# Altium schematic sheet Channel_B.SchDoc
size OrCAD E; SheetNumber: 4; SheetTotal: 4
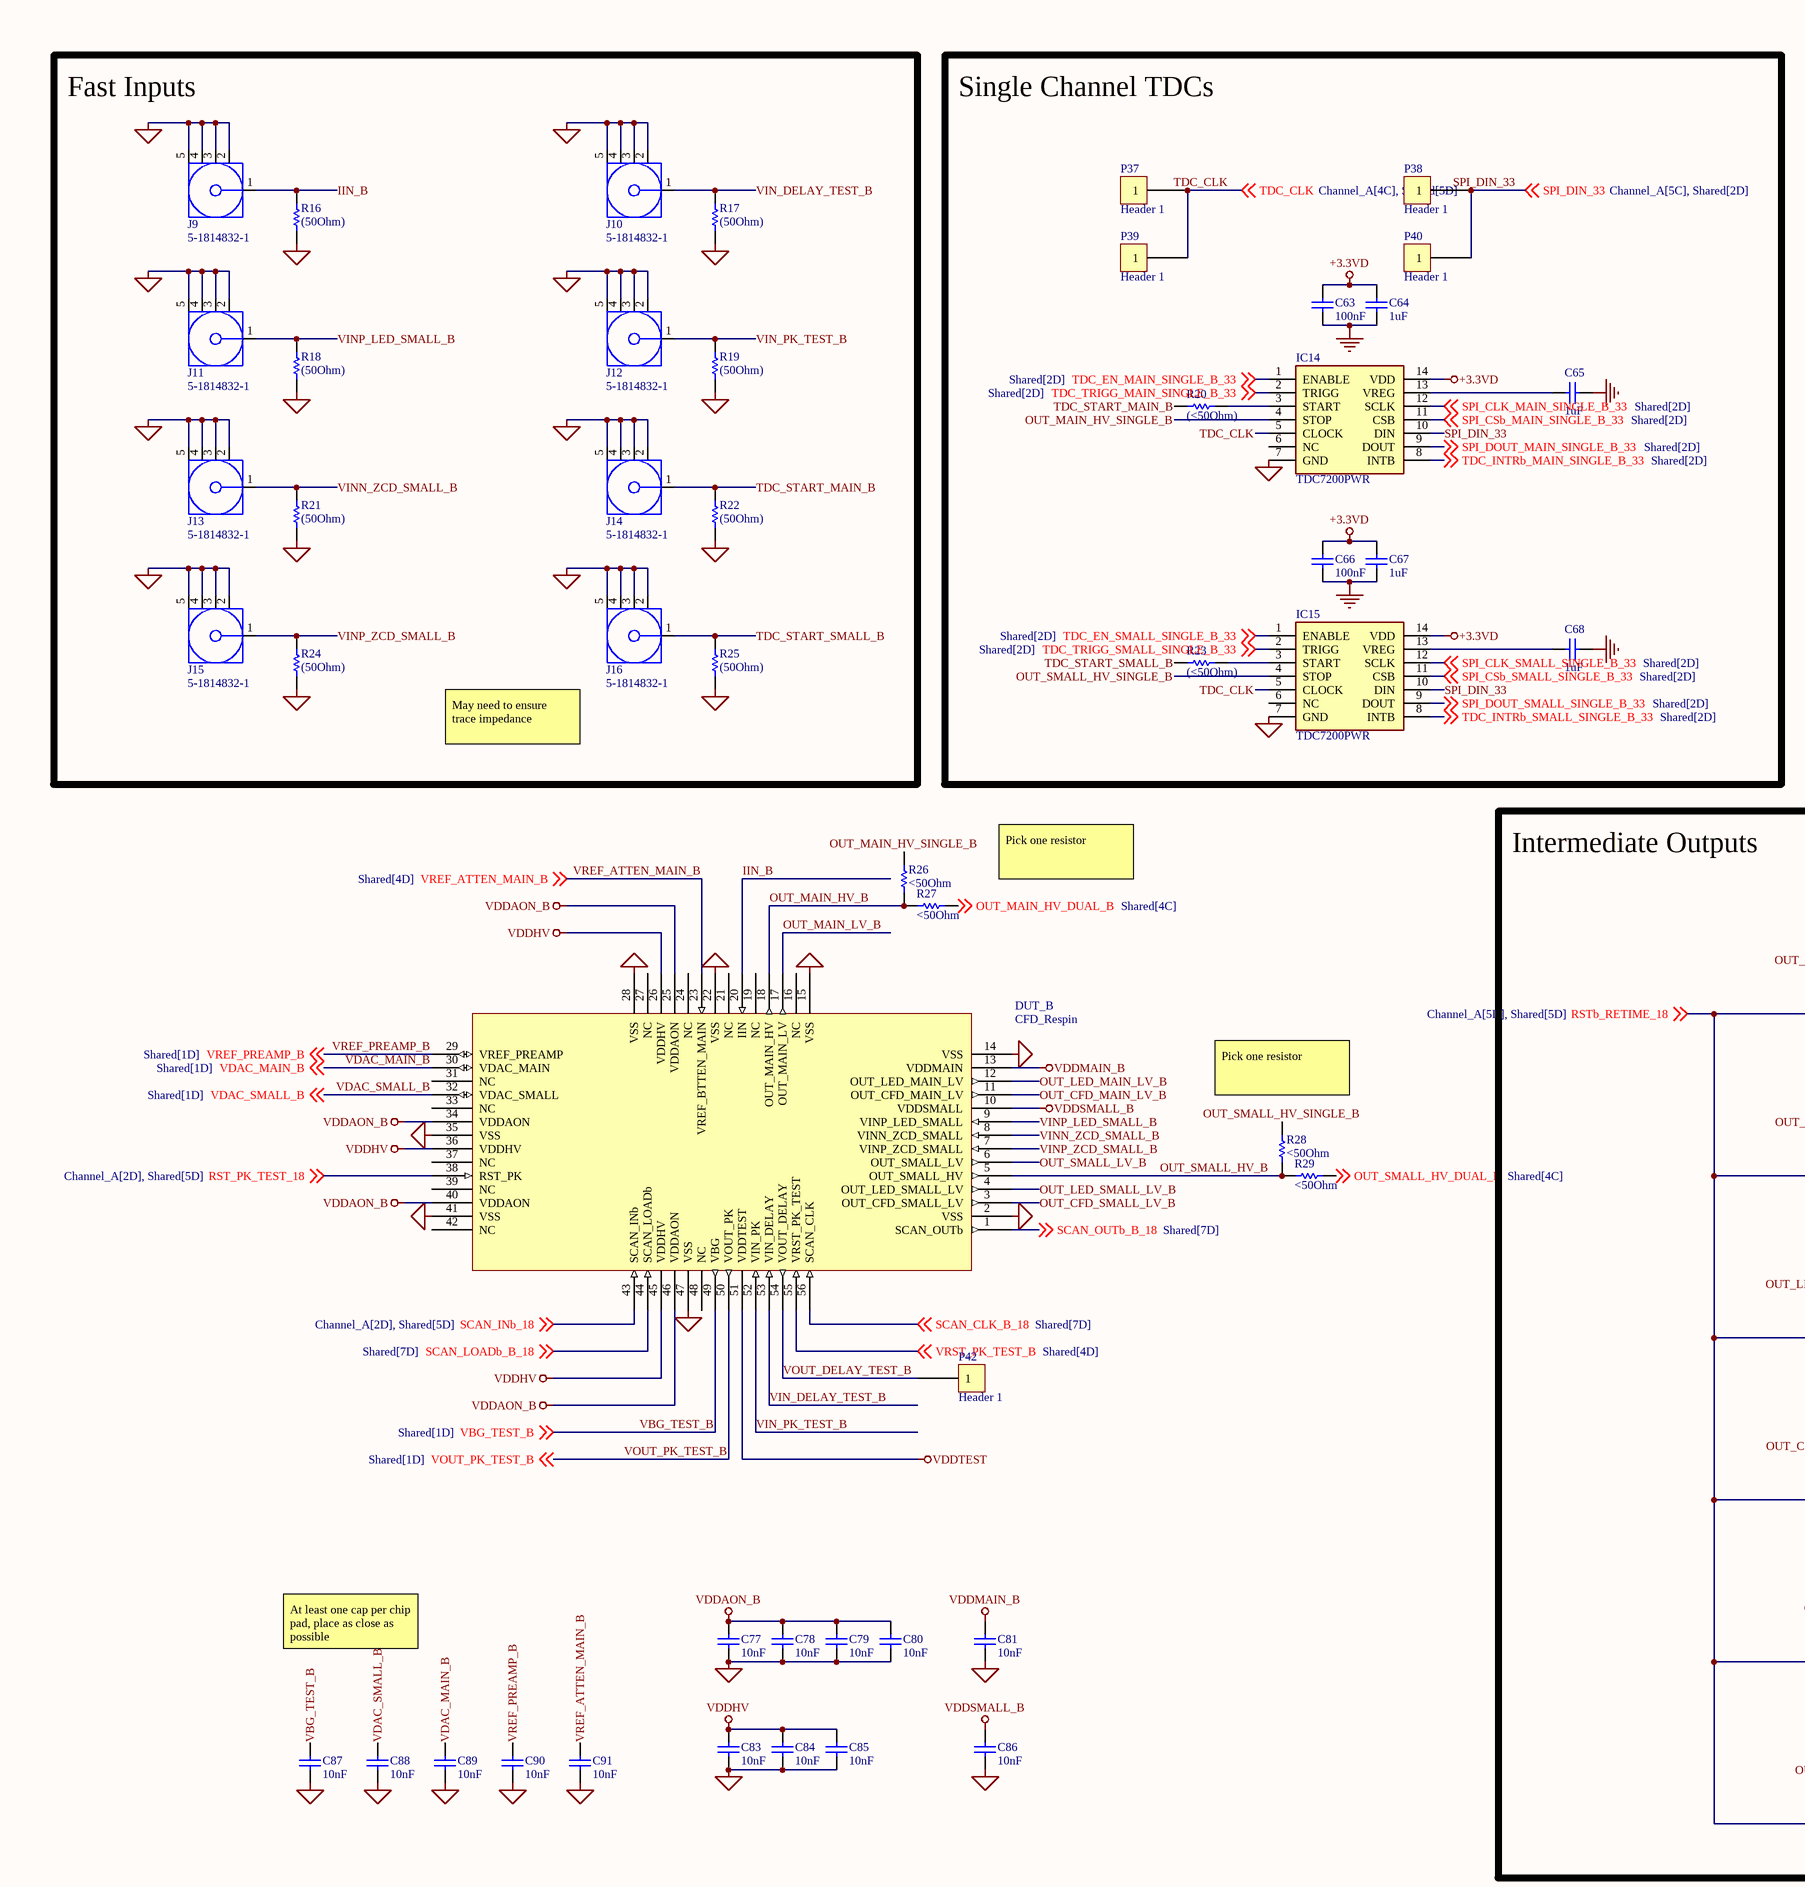
[diagram p0: Channel_B.SchDoc, left]
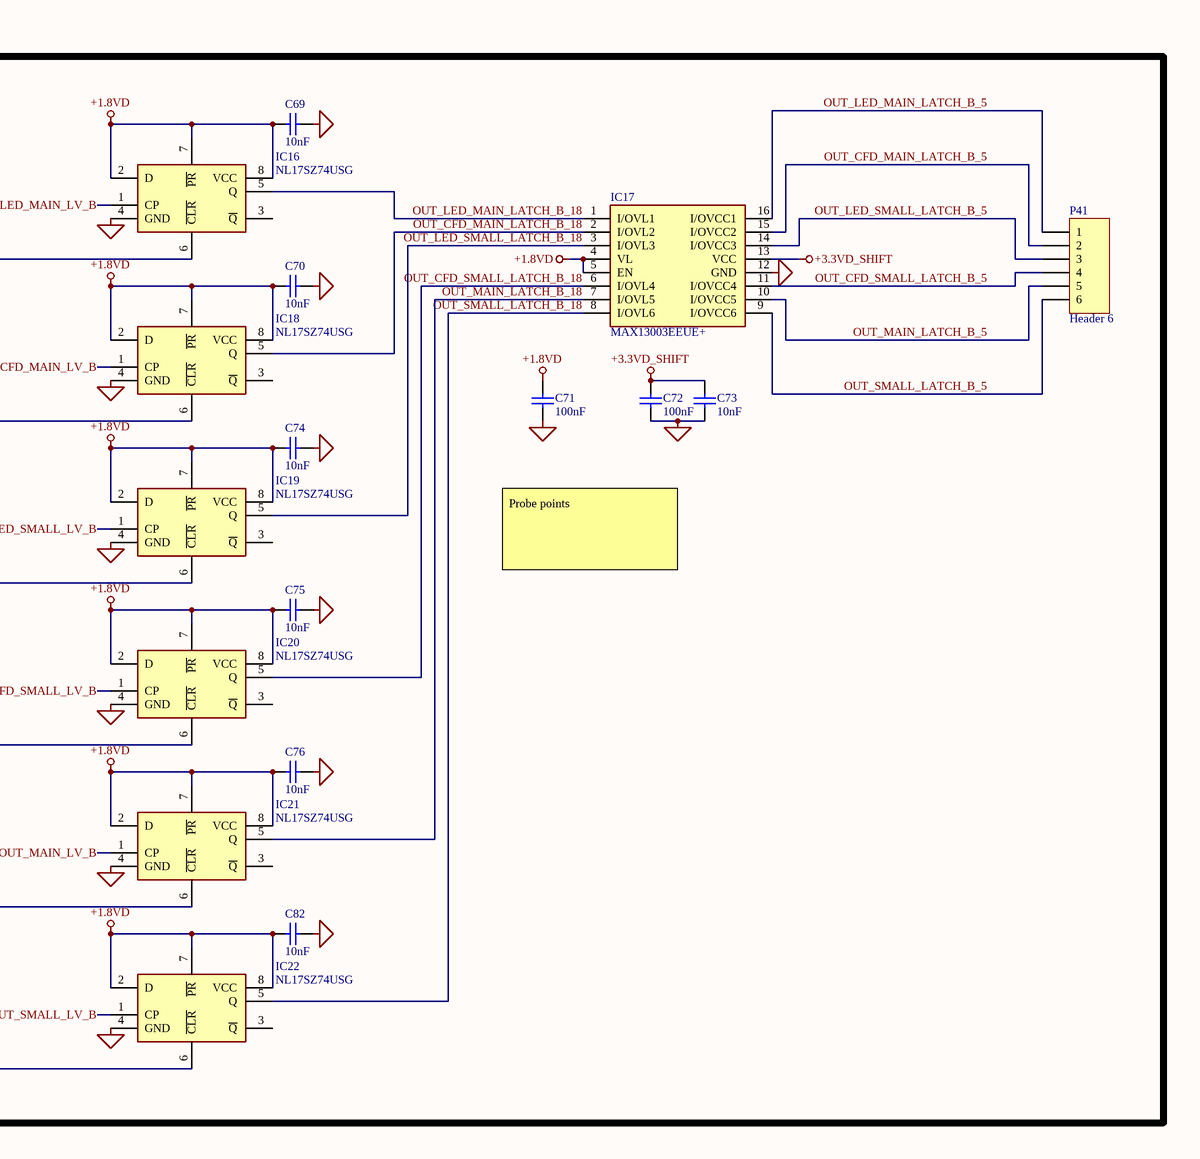
[diagram p1: Channel_B.SchDoc, right]

## Parts
C63  100nF  [CAPC1608X90X35ML10T15]
C64  1uF  [CAPC1608X90X35ML10T15]
C65  1uF  [CAPC1608X90X35ML10T15]
C66  100nF  [CAPC1608X90X35ML10T15]
C67  1uF  [CAPC1608X90X35ML10T15]
C68  1uF  [CAPC1608X90X35ML10T15]
C69  10nF  [CAPC1608X90X35ML10T15]
C70  10nF  [CAPC1608X90X35ML10T15]
C71  100nF  [CAPC1608X90X35ML10T15]
C72  100nF  [CAPC1608X90X35ML10T15]
C73  10nF  [CAPC1608X90X35ML10T15]
C74  10nF  [CAPC1608X90X35ML10T15]
C75  10nF  [CAPC1608X90X35ML10T15]
C76  10nF  [CAPC1608X90X35ML10T15]
C77  10nF  [CAPC1608X90X35ML10T15]
C78  10nF  [CAPC1608X90X35ML10T15]
C79  10nF  [CAPC1608X90X35ML10T15]
C80  10nF  [CAPC1608X90X35ML10T15]
C81  10nF  [CAPC1608X90X35ML10T15]
C82  10nF  [CAPC1608X90X35ML10T15]
C83  10nF  [CAPC1608X90X35ML10T15]
C84  10nF  [CAPC1608X90X35ML10T15]
C85  10nF  [CAPC1608X90X35ML10T15]
C86  10nF  [CAPC1608X90X35ML10T15]
C87  10nF  [CAPC1608X90X35ML10T15]
C88  10nF  [CAPC1608X90X35ML10T15]
C89  10nF  [CAPC1608X90X35ML10T15]
C90  10nF  [CAPC1608X90X35ML10T15]
C91  10nF  [CAPC1608X90X35ML10T15]
DUT_B  CFD_Respin  [QFN50P800X800X80_HS-57N_WIDEVIAS]
IC14  TDC7200PWR  [SOP65P640X120-14N]
IC15  TDC7200PWR  [SOP65P640X120-14N]
IC16  NL17SZ74USG  [SOP50P310X90-8N]
IC17  MAX13003EEUE+  [SOP65P640X110-16N]
IC18  NL17SZ74USG  [SOP50P310X90-8N]
IC19  NL17SZ74USG  [SOP50P310X90-8N]
IC20  NL17SZ74USG  [SOP50P310X90-8N]
IC21  NL17SZ74USG  [SOP50P310X90-8N]
IC22  NL17SZ74USG  [SOP50P310X90-8N]
J9  5-1814832-1  [TECO-5-1814832-1_V]
J10  5-1814832-1  [TECO-5-1814832-1_V]
J11  5-1814832-1  [TECO-5-1814832-1_V]
J12  5-1814832-1  [TECO-5-1814832-1_V]
J13  5-1814832-1  [TECO-5-1814832-1_V]
J14  5-1814832-1  [TECO-5-1814832-1_V]
J15  5-1814832-1  [TECO-5-1814832-1_V]
J16  5-1814832-1  [TECO-5-1814832-1_V]
P37  Header 1  [Header1]
P38  Header 1  [Header1]
P39  Header 1  [Header1]
P40  Header 1  [Header1]
P41  Header 6  [HDR1X6]
P42  Header 1  [Header1]
R16  (50Ohm)  [RESC1609X50X30NL8T20]
R17  (50Ohm)  [RESC1609X50X30NL8T20]
R18  (50Ohm)  [RESC1609X50X30NL8T20]
R19  (50Ohm)  [RESC1609X50X30NL8T20]
R20  (<50Ohm)  [RESC1609X50X30NL8T20]
R21  (50Ohm)  [RESC1609X50X30NL8T20]
R22  (50Ohm)  [RESC1609X50X30NL8T20]
R23  (<50Ohm)  [RESC1609X50X30NL8T20]
R24  (50Ohm)  [RESC1609X50X30NL8T20]
R25  (50Ohm)  [RESC1609X50X30NL8T20]
R26  <50Ohm  [RESC1609X50X30NL8T20]
R27  <50Ohm  [RESC1609X50X30NL8T20]
R28  <50Ohm  [RESC1609X50X30NL8T20]
R29  <50Ohm  [RESC1609X50X30NL8T20]

## Blocks framed on the sheet
Fast Inputs: J9-J16 R16-R19 R21 R22 R24 R25
Single Channel TDCs: C63-C68 IC14 IC15 P37-P40 R20 R23
Intermediate Outputs: C69-C76 C82 IC16-IC22 P41

## Nets
+1.8VD: C69.2 C70.2 C71.2 C74.2 C75.2 C76.2 C82.2 IC16.2(D) IC16.7(~{PR}) IC16.8(VCC) IC17.4(VL) IC17.5(EN) IC18.2(D) IC18.7(~{PR}) IC18.8(VCC) IC19.2(D) IC19.7(~{PR}) IC19.8(VCC) IC20.2(D) IC20.7(~{PR}) IC20.8(VCC) IC21.2(D) IC21.7(~{PR}) IC21.8(VCC) IC22.2(D) IC22.7(~{PR}) IC22.8(VCC)
+3.3VD: C63.1 C64.1 C66.1 C67.1 IC14.14(VDD) IC15.14(VDD)
+3.3VD_SHIFT: C72.2 C73.2 IC17.13(VCC)
GND: C63.2 C64.2 C65.2 C66.2 C67.2 C68.2 C69.1 C70.1 C71.1 C72.1 C73.1 C74.1 C75.1 C76.1 C77.1 C78.1 C79.1 C80.1 C81.1 C82.1 C83.1 C84.1 C85.1 C86.1 C87.1 C88.1 C89.1 C90.1 C91.1 DUT_B.2(VSS) DUT_B.14(VSS) DUT_B.15(VSS) DUT_B.22(VSS) DUT_B.28(VSS) DUT_B.35(VSS) DUT_B.41(VSS) DUT_B.47(VSS) IC14.7(GND) IC15.7(GND) IC16.4(GND) IC17.12(GND) IC18.4(GND) IC19.4(GND) IC20.4(GND) IC21.4(GND) IC22.4(GND) J9.2 J9.3 J9.4 J9.5 J10.2 J10.3 J10.4 J10.5 J11.2 J11.3 J11.4 J11.5 J12.2 J12.3 J12.4 J12.5 J13.2 J13.3 J13.4 J13.5 J14.2 J14.3 J14.4 J14.5 J15.2 J15.3 J15.4 J15.5 J16.2 J16.3 J16.4 J16.5 R16.1 R17.1 R18.1 R19.1 R21.1 R22.1 R24.1 R25.1
VDDAON_B: C77.2 C78.2 C79.2 C80.2 DUT_B.25(VDDAON) DUT_B.34(VDDAON) DUT_B.40(VDDAON) DUT_B.46(VDDAON)
VDDHV: C83.2 C84.2 C85.2 DUT_B.26(VDDHV) DUT_B.36(VDDHV) DUT_B.45(VDDHV)
VDDMAIN_B: C81.2 DUT_B.13(VDDMAIN)
VDDSMALL_B: C86.2 DUT_B.10(VDDSMALL)
VDDTEST: DUT_B.51(VDDTEST)
IIN_B: DUT_B.20(IIN) J9.1 R16.2
OUT_CFD_MAIN_LATCH_B_5: IC17.15(I/OVCC2) P41.2
OUT_CFD_MAIN_LATCH_B_18: IC17.2(I/OVL2) IC18.5(Q)
OUT_CFD_MAIN_LV_B: DUT_B.11(OUT_CFD_MAIN_LV) IC18.1(CP)
OUT_CFD_SMALL_LATCH_B_5: IC17.11(I/OVCC4) P41.4
OUT_CFD_SMALL_LATCH_B_18: IC17.6(I/OVL4) IC20.5(Q)
OUT_CFD_SMALL_LV_B: DUT_B.3(OUT_CFD_SMALL_LV) IC20.1(CP)
OUT_LED_MAIN_LATCH_B_5: IC17.16(I/OVCC1) P41.1
OUT_LED_MAIN_LATCH_B_18: IC16.5(Q) IC17.1(I/OVL1)
OUT_LED_MAIN_LV_B: DUT_B.12(OUT_LED_MAIN_LV) IC16.1(CP)
OUT_LED_SMALL_LATCH_B_5: IC17.14(I/OVCC3) P41.3
OUT_LED_SMALL_LATCH_B_18: IC17.3(I/OVL3) IC19.5(Q)
OUT_LED_SMALL_LV_B: DUT_B.4(OUT_LED_SMALL_LV) IC19.1(CP)
OUT_MAIN_HV_B: DUT_B.18(OUT_MAIN_HV) R26.2 R27.1
OUT_MAIN_HV_DUAL_B: R27.2 ; off-sheet OUT_MAIN_HV_DUAL_B
OUT_MAIN_HV_SINGLE_B: IC14.4(STOP) R26.1
OUT_MAIN_LATCH_B_5: IC17.10(I/OVCC5) P41.5
OUT_MAIN_LATCH_B_18: IC17.7(I/OVL5) IC21.5(Q)
OUT_MAIN_LV_B: DUT_B.17(OUT_MAIN_LV) IC21.1(CP)
OUT_SMALL_HV_B: DUT_B.5(OUT_SMALL_HV) R28.2 R29.1
OUT_SMALL_HV_DUAL_B: R29.2 ; off-sheet OUT_SMALL_HV_DUAL_B
OUT_SMALL_HV_SINGLE_B: IC15.4(STOP) R28.1
OUT_SMALL_LATCH_B_5: IC17.9(I/OVCC6) P41.6
OUT_SMALL_LATCH_B_18: IC17.8(I/OVL6) IC22.5(Q)
OUT_SMALL_LV_B: DUT_B.6(OUT_SMALL_LV) IC22.1(CP)
RST_PK_TEST_18: DUT_B.38(RST_PK) ; off-sheet RST_PK_TEST_18
RSTb_RETIME_18: IC16.6(~{CLR}) IC18.6(~{CLR}) IC19.6(~{CLR}) IC20.6(~{CLR}) IC21.6(~{CLR}) IC22.6(~{CLR}) ; off-sheet RSTb_RETIME_18
SCAN_CLK_B_18: DUT_B.56(SCAN_CLK) ; off-sheet SCAN_CLK_B_18
SCAN_INb_18: DUT_B.43(SCAN_INb) ; off-sheet SCAN_INb_18
SCAN_LOADb_B_18: DUT_B.44(SCAN_LOADb) ; off-sheet SCAN_LOADb_B_18
SCAN_OUTb_B_18: DUT_B.1(SCAN_OUTb) ; off-sheet SCAN_OUTb_B_18
SPI_CLK_MAIN_SINGLE_B_33: IC14.12(SCLK) ; off-sheet SPI_CLK_MAIN_SINGLE_B_33
SPI_CLK_SMALL_SINGLE_B_33: IC15.12(SCLK) ; off-sheet SPI_CLK_SMALL_SINGLE_B_33
SPI_CSb_MAIN_SINGLE_B_33: IC14.11(CSB) ; off-sheet SPI_CSb_MAIN_SINGLE_B_33
SPI_CSb_SMALL_SINGLE_B_33: IC15.11(CSB) ; off-sheet SPI_CSb_SMALL_SINGLE_B_33
SPI_DIN_33: IC14.10(DIN) IC15.10(DIN) P38.1 P40.1 ; off-sheet SPI_DIN_33
SPI_DOUT_MAIN_SINGLE_B_33: IC14.9(DOUT) ; off-sheet SPI_DOUT_MAIN_SINGLE_B_33
SPI_DOUT_SMALL_SINGLE_B_33: IC15.9(DOUT) ; off-sheet SPI_DOUT_SMALL_SINGLE_B_33
TDC_CLK: IC14.5(CLOCK) IC15.5(CLOCK) P37.1 P39.1 ; off-sheet TDC_CLK
TDC_EN_MAIN_SINGLE_B_33: IC14.1(ENABLE) ; off-sheet TDC_EN_MAIN_SINGLE_B_33
TDC_EN_SMALL_SINGLE_B_33: IC15.1(ENABLE) ; off-sheet TDC_EN_SMALL_SINGLE_B_33
TDC_INTRb_MAIN_SINGLE_B_33: IC14.8(INTB) ; off-sheet TDC_INTRb_MAIN_SINGLE_B_33
TDC_INTRb_SMALL_SINGLE_B_33: IC15.8(INTB) ; off-sheet TDC_INTRb_SMALL_SINGLE_B_33
TDC_START_MAIN_B: J14.1 R20.1 R22.2
TDC_START_SMALL_B: J16.1 R23.1 R25.2
TDC_TRIGG_MAIN_SINGLE_B_33: IC14.2(TRIGG) ; off-sheet TDC_TRIGG_MAIN_SINGLE_B_33
TDC_TRIGG_SMALL_SINGLE_B_33: IC15.2(TRIGG) ; off-sheet TDC_TRIGG_SMALL_SINGLE_B_33
VBG_TEST_B: C87.2 DUT_B.49(VBG) ; off-sheet VBG_TEST_B
VDAC_MAIN_B: C89.2 DUT_B.30(VDAC_MAIN) ; off-sheet VDAC_MAIN_B
VDAC_SMALL_B: C88.2 DUT_B.32(VDAC_SMALL) ; off-sheet VDAC_SMALL_B
VIN_DELAY_TEST_B: DUT_B.53(VIN_DELAY) J10.1 R17.2
VIN_PK_TEST_B: DUT_B.52(VIN_PK) J12.1 R19.2
VINN_ZCD_SMALL_B: DUT_B.8(VINN_ZCD_SMALL) J13.1 R21.2
VINP_LED_SMALL_B: DUT_B.9(VINP_LED_SMALL) J11.1 R18.2
VINP_ZCD_SMALL_B: DUT_B.7(VINP_ZCD_SMALL) J15.1 R24.2
VOUT_DELAY_TEST_B: DUT_B.54(VOUT_DELAY) P42.1
VOUT_PK_TEST_B: DUT_B.50(VOUT_PK) ; off-sheet VOUT_PK_TEST_B
VREF_ATTEN_MAIN_B: C91.2 DUT_B.23(VREF_BTTEN_MAIN) ; off-sheet VREF_ATTEN_MAIN_B
VREF_PREAMP_B: C90.2 DUT_B.29(VREF_PREAMP) ; off-sheet VREF_PREAMP_B
VRST_PK_TEST_B: DUT_B.55(VRST_PK_TEST) ; off-sheet VRST_PK_TEST_B
NetC65_1: C65.1 IC14.13(VREG)
NetC68_1: C68.1 IC15.13(VREG)
NetIC14_3: IC14.3(START) R20.2
NetIC15_3: IC15.3(START) R23.2

Not connected (* = marked no-connect by the designer): DUT_B 16(NC) 19(NC) 21(NC) 24(NC) 27(NC) 31(NC) 33(NC) 37(NC) 39(NC) 42(NC) 48(NC); IC14 6(NC); IC15 6(NC); IC16 3(~{Q}); IC18 3(~{Q}); IC19 3(~{Q}); IC20 3(~{Q}); IC21 3(~{Q}); IC22 3(~{Q})

## Notes on the sheet
- May need to ensure trace impedance
- Pick one resistor
- (near R28) Pick one resistor
- Probe points
- At least one cap per chip pad, place as close as possible

## Library data of the parts
C63-C91 = CMP-2000-04945-1: 0603; Manufacturer: Murata; Capacitance: 22pF; Tolerance (%): ±5%; Rated Voltage: 50V; Dielectric: C0G; Manufacturer URL: http://www.murata.com/; Datasheet Version: Jul-06; Package Reference: 603; Case Size/Dimension: 0603; Package Description: 2-Pin Surface Mount Device, Body 1.6 x 0.8 mm; Datasheet URL: https://datasheet.ciiva.com/11786/0900766b807a1cab-11786398.pdf
IC14 IC15 = TDC7200PWR: Integrated Circuit; Manufacturer_Name: Texas Instruments; Datasheet Link: http://www.ti.com/lit/gpn/tdc7200; Height: 1.2mm; Manufacturer_Part_Number: TDC7200PWR
IC16 IC18-IC22 = NL17SZ74USG: Flip Flops 1.65-5.5V CMOS Single D-Type; Manufacturer_Name: ON Semiconductor; Datasheet Link: http://www.onsemi.com/pub/Collateral/NL17SZ74-D.PDF; Height: 0.9mm; Manufacturer_Part_Number: NL17SZ74USG
IC17 = MAX13003EEUE+: Integrated Circuit; Manufacturer_Name: Maxim Integrated; Datasheet Link: https://pdfserv.maximintegrated.com/en/ds/MAX13000E-MAX13005E.pdf; Height: 1.1mm; Manufacturer_Part_Number: MAX13003EEUE+
J9-J16 = CMP-2000-05415-1: SMA Connector, Pitch 5.08 mm, 1 Position, Height 9.5 mm, Tail Length 4 mm, -65 to 165 degC, RoHS, Bulk; Manufacturer: TE Connectivity; Connector Mounting: PCBMount; Connector Body Style: StraightJack; Impedance: 50ohm; Coaxial Termination: Solder; SVHC: NoSVHC(15-Jun-2015); Frequency Max: 3GHz; Product Range: ZDCSeries; Connector Type: SMACoaxial; Datasheet Version: Rev. B1, 03/2011; Package Reference: 5-1814832-1; Package Description: SMA Connector, Pitch 5.08 mm, 1 Position, Height 9.5 mm, Tail Length 4 mm; Contact Plating: GoldPlatedContacts; Coaxial Cable Types: -; Contact Material: BerylliumCopper; Manufacturer URL: http://www.te.com/; Datasheet URL: http://www.onlinecomponents.com/productFiles/mf-AMP/eng_cd_1814832_a.pdf
P41 = Header 6: Header, 6-Pin; LatestRevisionDate: 17-Jul-2002; LatestRevisionNote: Re-released for DXP Platform.; Publisher: Altium Limited
R16-R29 = CMP-2000-03816-5: 0603; Manufacturer: Vishay Semiconductor; Voltage Rating: 75 V; Package Quantity: 5000; DatasheetVersion: 06/2012; Min Operating Temperature: -55 degC; ComponentLink1URL: http://www.vishay.com/; Mounting Technology: Surface Mount; Height: 0.45 mm; ComponentLink1Description: Manufacturer URL; REACH SVHC: Unknown; PackageReference: 0603; Packaging: Tape and Reel; Max Operating Temperature: 155 degC; Mount: Surface Mount; ComponentLink2Description: Datasheet; PackageDescription: 2-Pin Surface Mount Device, Body 1.575 x 0.85 mm; Length: 1.55 mm; ComponentLink2URL: http://www.vishay.com/docs/20035/dcrcwe3.pdf; Pins: 2; RoHSCompliant: true